# Altium schematic sheet Э3-1 УВ ЦАП.SchDoc
size 594 x 420 mm; Address1: Address1; Address2: Address2; Address3: Address3; Address4: Address4; SheetNumber: 2; SheetTotal: 7; DocumentType: Схема электрическая принципиальная
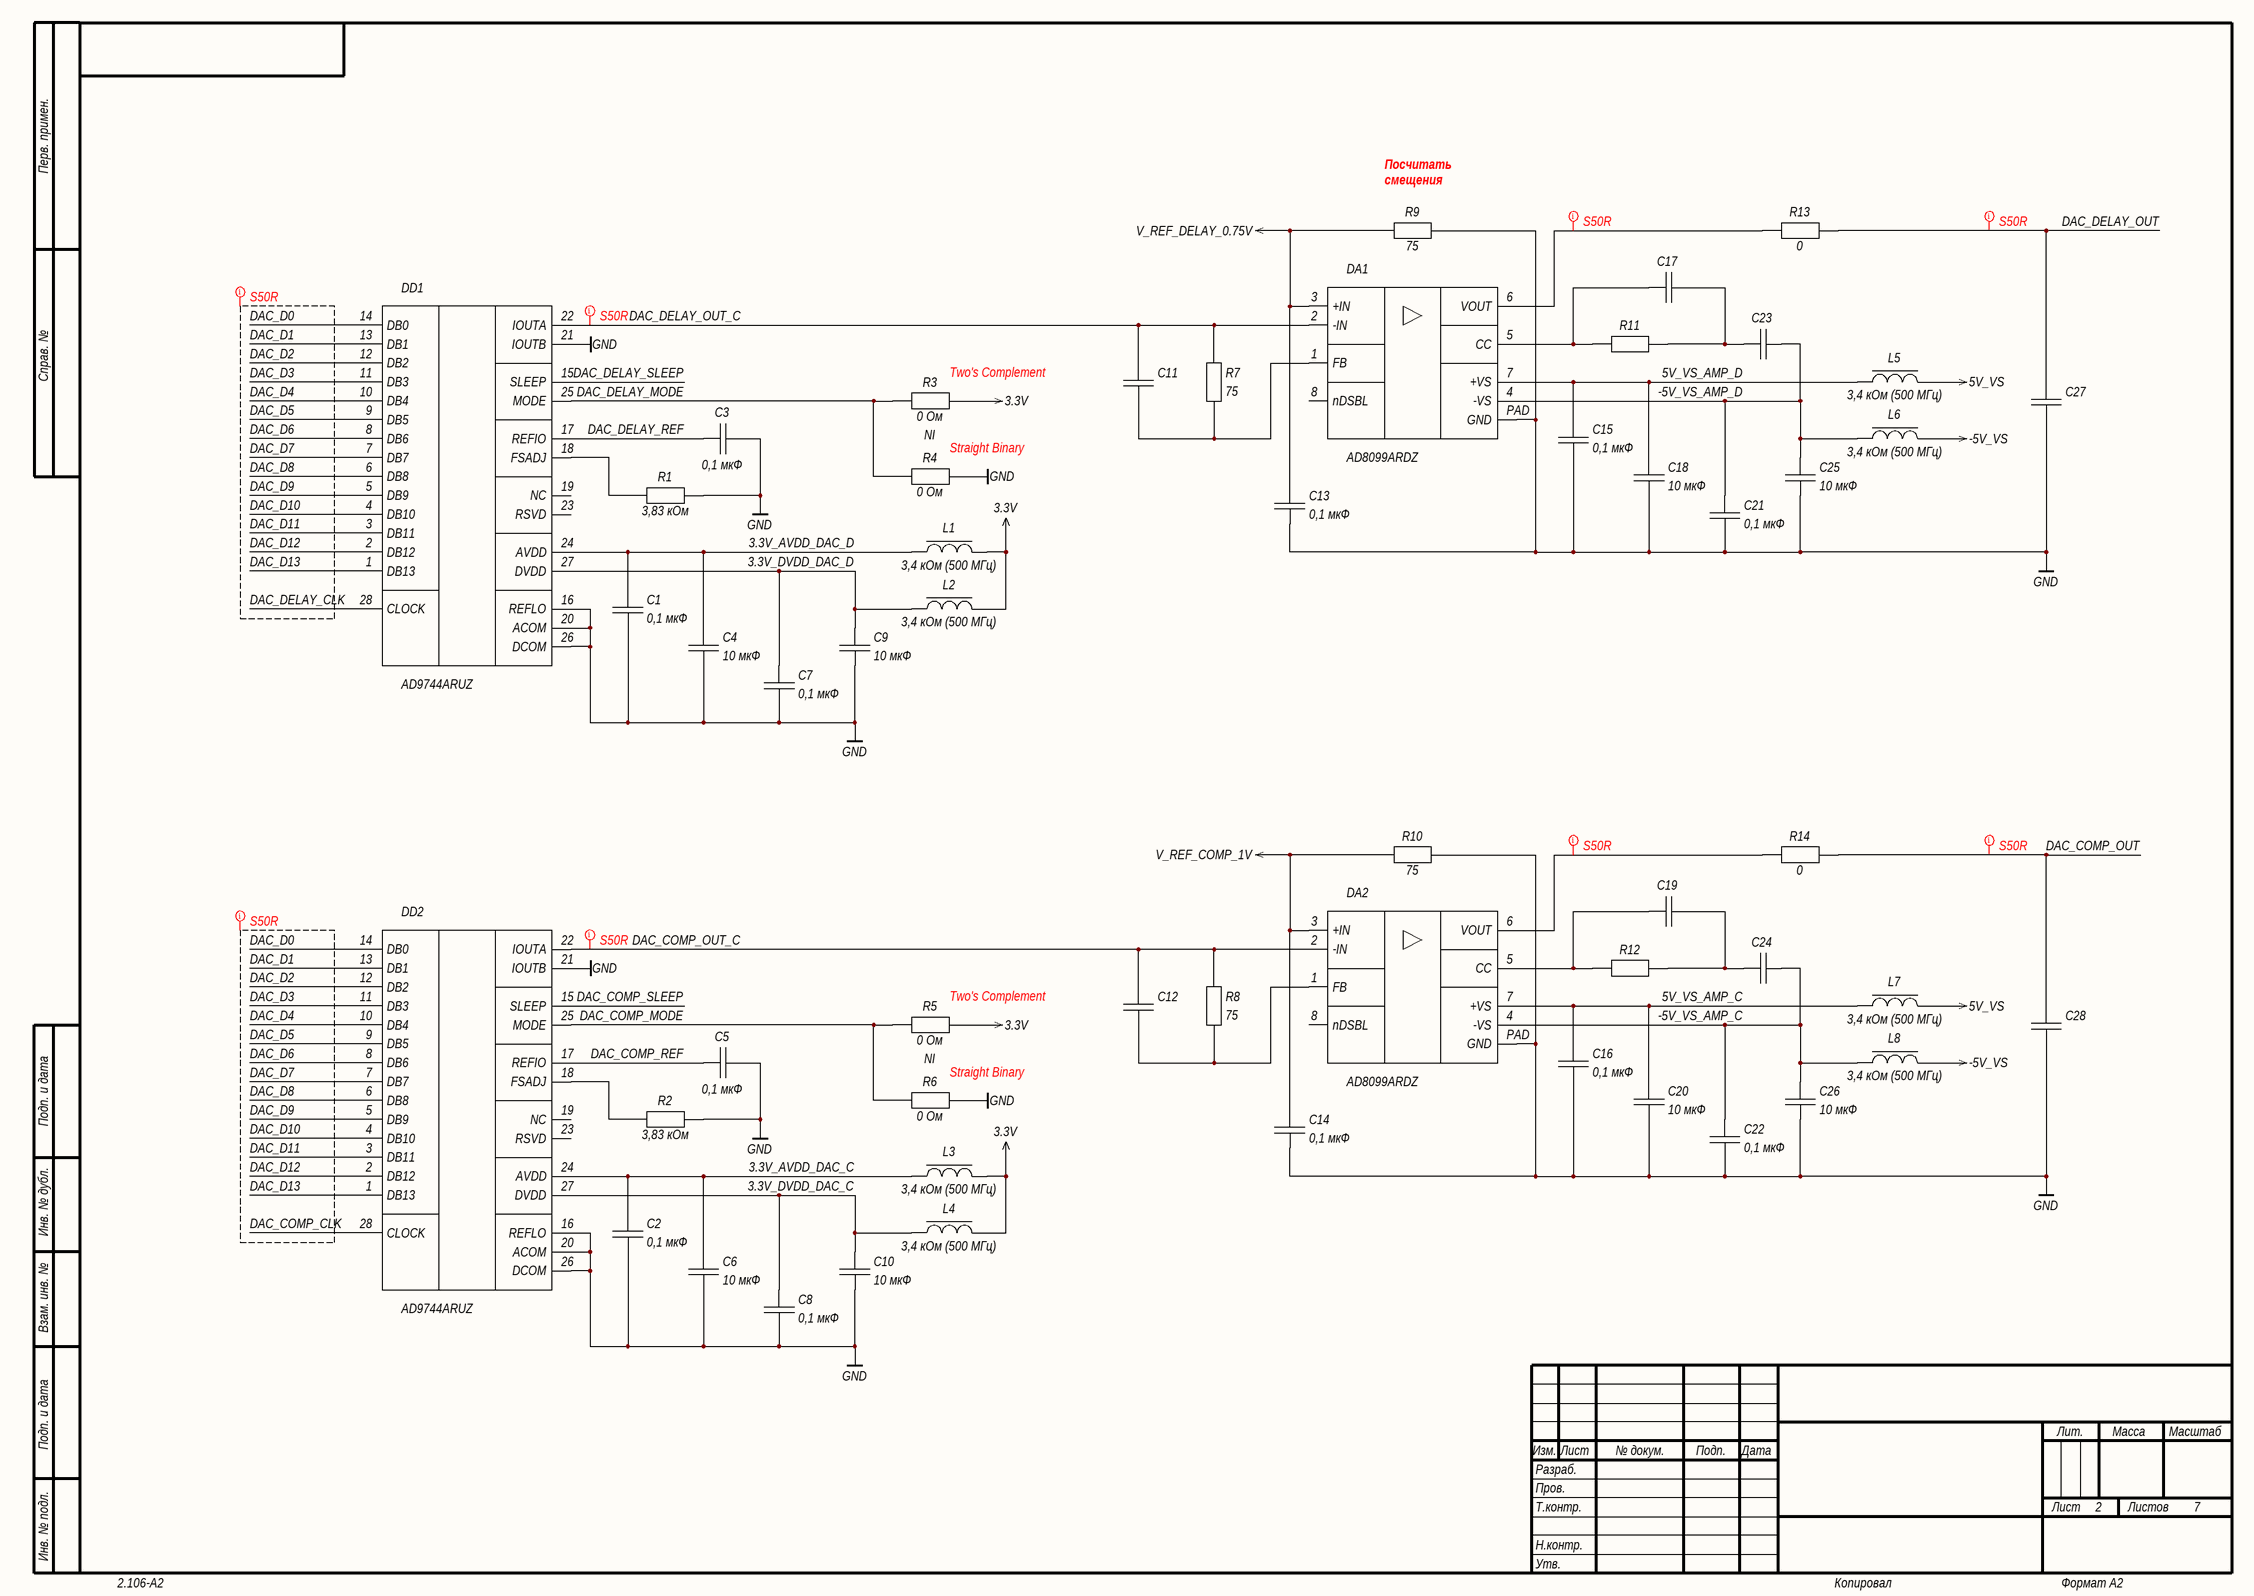
[diagram p0: Э3-1 УВ ЦАП.SchDoc]

## Parts
C1  value 0,1 мкФ  [C0402-B-0.5mm]
C2  value 0,1 мкФ  [C0402-B-0.5mm]
C3  value 0,1 мкФ  [C0402-B-0.5mm]
C4  value 10 мкФ  [C0603-B-0.8mm]
C5  value 0,1 мкФ  [C0402-B-0.5mm]
C6  value 10 мкФ  [C0603-B-0.8mm]
C7  value 0,1 мкФ  [C0402-B-0.5mm]
C8  value 0,1 мкФ  [C0402-B-0.5mm]
C9  value 10 мкФ  [C0603-B-0.8mm]
C10  value 10 мкФ  [C0603-B-0.8mm]
C11  (no value)  [C0402-B-0.5mm]
C12  (no value)  [C0402-B-0.5mm]
C13  value 0,1 мкФ  [C0402-B-0.5mm]
C14  value 0,1 мкФ  [C0402-B-0.5mm]
C15  value 0,1 мкФ  [C0402-B-0.5mm]
C16  value 0,1 мкФ  [C0402-B-0.5mm]
C17  (no value)  [C0402-B-0.5mm]
C18  value 10 мкФ  [C0603-B-0.8mm]
C19  (no value)  [C0402-B-0.5mm]
C20  value 10 мкФ  [C0603-B-0.8mm]
C21  value 0,1 мкФ  [C0402-B-0.5mm]
C22  value 0,1 мкФ  [C0402-B-0.5mm]
C23  (no value)  [C0402-B-0.5mm]
C24  (no value)  [C0402-B-0.5mm]
C25  value 10 мкФ  [C0603-B-0.8mm]
C26  value 10 мкФ  [C0603-B-0.8mm]
C27  (no value)  [C0402-B-0.5mm]
C28  (no value)  [C0402-B-0.5mm]
DA1  AD8099ARDZ  [8-SOIC-EP-3.9]
DA2  AD8099ARDZ  [8-SOIC-EP-3.9]
DD1  AD9744ARUZ  [28-TSSOP-4.4]
DD2  AD9744ARUZ  [28-TSSOP-4.4]
L1  value 3,4 кОм (500 МГц)  [L0402-B-0.5mm]
L2  value 3,4 кОм (500 МГц)  [L0402-B-0.5mm]
L3  value 3,4 кОм (500 МГц)  [L0402-B-0.5mm]
L4  value 3,4 кОм (500 МГц)  [L0402-B-0.5mm]
L5  value 3,4 кОм (500 МГц)  [L0402-B-0.5mm]
L6  value 3,4 кОм (500 МГц)  [L0402-B-0.5mm]
L7  value 3,4 кОм (500 МГц)  [L0402-B-0.5mm]
L8  value 3,4 кОм (500 МГц)  [L0402-B-0.5mm]
R1  value 3,83 кОм  [CR0402-B-0.35mm]
R2  value 3,83 кОм  [CR0402-B-0.35mm]
R3  value 0 Ом  ComponentType: NI  [CR0402-B-0.35mm]
R4  value 0 Ом  [CR0402-B-0.35mm]
R5  value 0 Ом  ComponentType: NI  [CR0402-B-0.35mm]
R6  value 0 Ом  [CR0402-B-0.35mm]
R7  value 75  [CR0402-B-0.35mm]
R8  value 75  [CR0402-B-0.35mm]
R9  value 75  [CR0402-B-0.35mm]
R10  value 75  [CR0402-B-0.35mm]
R11  (no value)  [CR0402-B-0.35mm]
R12  (no value)  [CR0402-B-0.35mm]
R13  value 0  [CR0402-B-0.35mm]
R14  value 0  [CR0402-B-0.35mm]

## Nets
3.3V: L1.2 L2.2 L3.2 L4.2 R3.2 R5.2
5V_VS: L5.2 L7.2
-5V_VS: L6.2 L8.2
GND: C1.2 C2.2 C3.2 C4.2 C5.2 C6.2 C7.2 C8.2 C9.2 C10.2 C13.2 C14.2 C15.2 C16.2 C18.2 C20.2 C21.2 C22.2 C25.2 C26.2 C27.2 C28.2 DA1.PAD(GND) DA2.PAD(GND) DD1.16(REFLO) DD1.20(ACOM) DD1.21(IOUTB) DD1.26(DCOM) DD2.16(REFLO) DD2.20(ACOM) DD2.21(IOUTB) DD2.26(DCOM) R1.2 R2.2 R4.2 R6.2 R9.2 R10.2
V_REF_COMP_1V: C14.1 DA2.3(+IN) R10.1
V_REF_DELAY_0.75V: C13.1 DA1.3(+IN) R9.1
3.3V_AVDD_DAC_C: C2.1 C6.1 DD2.24(AVDD) L3.1
3.3V_AVDD_DAC_D: C1.1 C4.1 DD1.24(AVDD) L1.1
3.3V_DVDD_DAC_C: C8.1 C10.1 DD2.27(DVDD) L4.1
3.3V_DVDD_DAC_D: C7.1 C9.1 DD1.27(DVDD) L2.1
5V_VS_AMP_C: C16.1 C20.1 DA2.7(+VS) L7.1
5V_VS_AMP_D: C15.1 C18.1 DA1.7(+VS) L5.1
-5V_VS_AMP_C: C22.1 C24.2 C26.1 DA2.4(-VS) L8.1
-5V_VS_AMP_D: C21.1 C23.2 C25.1 DA1.4(-VS) L6.1
DAC_COMP_CLK: DD2.28(CLOCK)
DAC_COMP_MODE: DD2.25(MODE) R5.1 R6.1
DAC_COMP_OUT: C28.1 R14.2
DAC_COMP_OUT_C: C12.1 DA2.2(-IN) DD2.22(IOUTA) R8.1
DAC_COMP_REF: C5.1 DD2.17(REFIO)
DAC_COMP_SLEEP: DD2.15(SLEEP)
DAC_D0: DD1.14(DB0) DD2.14(DB0)
DAC_D1: DD1.13(DB1) DD2.13(DB1)
DAC_D2: DD1.12(DB2) DD2.12(DB2)
DAC_D3: DD1.11(DB3) DD2.11(DB3)
DAC_D4: DD1.10(DB4) DD2.10(DB4)
DAC_D5: DD1.9(DB5) DD2.9(DB5)
DAC_D6: DD1.8(DB6) DD2.8(DB6)
DAC_D7: DD1.7(DB7) DD2.7(DB7)
DAC_D8: DD1.6(DB8) DD2.6(DB8)
DAC_D9: DD1.5(DB9) DD2.5(DB9)
DAC_D10: DD1.4(DB10) DD2.4(DB10)
DAC_D11: DD1.3(DB11) DD2.3(DB11)
DAC_D12: DD1.2(DB12) DD2.2(DB12)
DAC_D13: DD1.1(DB13) DD2.1(DB13)
DAC_DELAY_CLK: DD1.28(CLOCK)
DAC_DELAY_MODE: DD1.25(MODE) R3.1 R4.1
DAC_DELAY_OUT: C27.1 R13.2
DAC_DELAY_OUT_C: C11.1 DA1.2(-IN) DD1.22(IOUTA) R7.1
DAC_DELAY_REF: C3.1 DD1.17(REFIO)
DAC_DELAY_SLEEP: DD1.15(SLEEP)
NetC11_2: C11.2 DA1.1(FB) R7.2
NetC12_2: C12.2 DA2.1(FB) R8.2
NetC17_1: C17.1 DA1.5(CC) R11.1
NetC17_2: C17.2 C23.1 R11.2
NetC19_1: C19.1 DA2.5(CC) R12.1
NetC19_2: C19.2 C24.1 R12.2
NetDA1_6: DA1.6(VOUT) R13.1
NetDA2_6: DA2.6(VOUT) R14.1
NetDD1_18: DD1.18(FSADJ) R1.1
NetDD2_18: DD2.18(FSADJ) R2.1

Not connected (* = marked no-connect by the designer): DA1 8(nDSBL); DA2 8(nDSBL); DD1 19(NC) 23(RSVD); DD2 19(NC) 23(RSVD)

## Layout directives
net class S50R: DAC_COMP_CLK, DAC_COMP_OUT, DAC_COMP_OUT_C, DAC_D0, DAC_D1, DAC_D2, DAC_D3, DAC_D4, DAC_D5, DAC_D6, DAC_D7, DAC_D8, DAC_D9, DAC_D10, DAC_D11, DAC_D12, DAC_D13, DAC_DELAY_CLK, DAC_DELAY_OUT, DAC_DELAY_OUT_C, NetDA1_6, NetDA2_6

## Notes on the sheet
- (near R9) Посчитать смещения
- (near R3) Two's Complement
- (near R4) Straight Binary
- (near R5) Two's Complement
- (near R6) Straight Binary
- Перв. примен.
- Справ. №
- Подп. и дата
- Инв. № дубл.
- Взам. инв. №
- Разраб.
- Изм.
- Лист
- № докум.
- Подп.
- Дата
- Лит.
- Масса
- Масштаб
- Пров.
- Т.контр.
- Листов
- Инв. № подл.
- Утв.
- Н.контр.
- 2.106-A2
- Копировал
- Формат А2

## Library data of the parts
C1 C2 C7 C8 C13-C16 C21 C22 = Non Polar Ver.: 0402 X7R 0,1 мкФ ±10 % 50 В; PartNumber: GRM155R71H104KE14D; TemperatureRange: -XX...+XX°C; VoltageRating: 50 В; Manufacturer: *; Package: *; HelpURL: *; Tolerance: *; TypeDielectric: *; ESR: *; ComponentType: CAP
C3 C5 = Non Polar Hor.: 0402 X7R 0,1 мкФ ±10 % 50 В; PartNumber: GRM155R71H104KE14D; TemperatureRange: -XX...+XX°C; VoltageRating: 50 В; Manufacturer: *; Package: *; HelpURL: *; Tolerance: *; TypeDielectric: *; ESR: *; ComponentType: CAP
C4 C6 C9 C18 C20 C25 C26 = Non Polar Ver.: 0603 X5R 10 мкФ ±20 % 25 В; PartNumber: GRM188R61E106MA73; TemperatureRange: -XX...+XX°C; VoltageRating: 25 В; Manufacturer: *; Package: *; HelpURL: *; Tolerance: *; TypeDielectric: *; ESR: *; ComponentType: CAP
C10 = Non Polar Ver.: GRM188R61E106MA73; TemperatureRange: -XX...+XX°C; VoltageRating: 25 В; Manufacturer: *; PartNumber: GRM188R61E106MA73; Package: *; HelpURL: *; Tolerance: *; TypeDielectric: *; ESR: *; ComponentType: CAP
C11 C12 C27 C28 = Non Polar Ver.: TemperatureRange: -XX...+XX°C; Manufacturer: *; PartNumber: *; Package: *; HelpURL: *; Tolerance: *; TypeDielectric: *; ESR: *; ComponentType: CAP; VoltageRating: *
C17 C19 C23 C24 = Non Polar Hor.: TemperatureRange: -XX...+XX°C; Manufacturer: *; Package: *; HelpURL: *; Tolerance: *; TypeDielectric: *; ESR: *; ComponentType: CAP
DA1 DA2 = AD8099ARDZ: Ultralow Distortion, High Speed, 0.95 nV/√Hz Voltage Noise Op Amp; Manufacturer: Analog Devices, Inc.; TemperatureRange: -40...+125°C; Package: 8-SOIC-EP; PartNumber: AD8099ARDZ; ComponentType: IC; DatasheetURL: *; HelpURL: *; PinCount: 8
DD1 DD2 = AD9744ARUZ: 14-Bit, 210 MSPS TxDAC® / D/A Converter; Manufacturer: Analog Devices; TemperatureRange: -40...+85°C; Package: 28-TSSOP; PartNumber: AD9744ARUZ; ComponentType: IC; DatasheetURL: *; HelpURL: *; PinCount: 8
L1-L8 = Inductor MC Hor.: PartNumber: BLM15HD182BH1; TemperatureRange: -XX...+XX°C; Manufacturer: *; Package: *; HelpURL: *; MaxCurrent: *; ComponentType: IND; DatasheetURL: *; PinCount: 2
R1 R2 = Resistor Hor.: 0402 3,83 кОм ±1 %; TemperatureRange: -XX...+XX°C; Manufacturer: *; PartNumber: *; Package: *; HelpURL: *; PowerRating: *; Tolerance: *; DatasheetURL: *; ComponentType: RES
R3 R5 R13 R14 = Resistor Hor.: 0402 0 Ом; TemperatureRange: -XX...+XX°C; Manufacturer: *; PartNumber: *; Package: *; HelpURL: *; PowerRating: *; Tolerance: *; DatasheetURL: *
  R13 R14: ComponentType: RES
R4 R6 R11 R12 = Resistor Hor.: TemperatureRange: -XX...+XX°C; Manufacturer: *; PartNumber: *; Package: *; HelpURL: *; PowerRating: *; Tolerance: *; DatasheetURL: *; ComponentType: RES
R7 R8 = Resistor Ver.: 0402 75 Ом ±1 %; TemperatureRange: -XX...+XX°C; Manufacturer: *; PartNumber: *; Package: *; HelpURL: *; PowerRating: *; DatasheetURL: *; Tolerance: *; ComponentType: RES
R9 R10 = Resistor Hor.: 0402 75 Ом ±1 %; TemperatureRange: -XX...+XX°C; Manufacturer: *; PartNumber: *; Package: *; HelpURL: *; PowerRating: *; Tolerance: *; DatasheetURL: *; ComponentType: RES